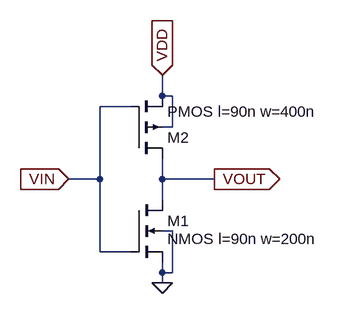
[diagram p0: schematic inverter.asc]
inverter.asc, the LTspice schematic file:
Version 4
SHEET 1 880 680
WIRE 240 16 240 -16
WIRE 256 16 240 16
WIRE 192 32 144 32
WIRE 256 64 256 16
WIRE 256 64 240 64
WIRE 144 144 144 32
WIRE 144 144 96 144
WIRE 240 144 240 112
WIRE 320 144 240 144
WIRE 240 176 240 144
WIRE 256 224 240 224
WIRE 144 256 144 144
WIRE 192 256 144 256
WIRE 240 288 240 272
WIRE 256 288 256 224
WIRE 256 288 240 288
WIRE 240 304 240 288
FLAG 320 144 VOUT
IOPIN 320 144 Out
FLAG 240 304 0
FLAG 240 -16 VDD
IOPIN 240 -16 In
FLAG 96 144 VIN
IOPIN 96 144 In
SYMBOL pmos4 192 112 M180
SYMATTR InstName M2
SYMATTR Value PMOS l=90n w=400n
SYMBOL nmos4 192 176 R0
WINDOW 3 56 60 Left 2
SYMATTR InstName M1
SYMATTR Value NMOS l=90n w=200n

The netlist it stands for:
* inverter.asc
M2 VOUT VIN VDD VDD PMOS l=90n w=400n
M1 VOUT VIN 0 0 NMOS l=90n w=200n
.model NMOS NMOS
.model PMOS PMOS
.lib standard.mos
.backanno
.end